# Altium project Cartridge.PrjPCB
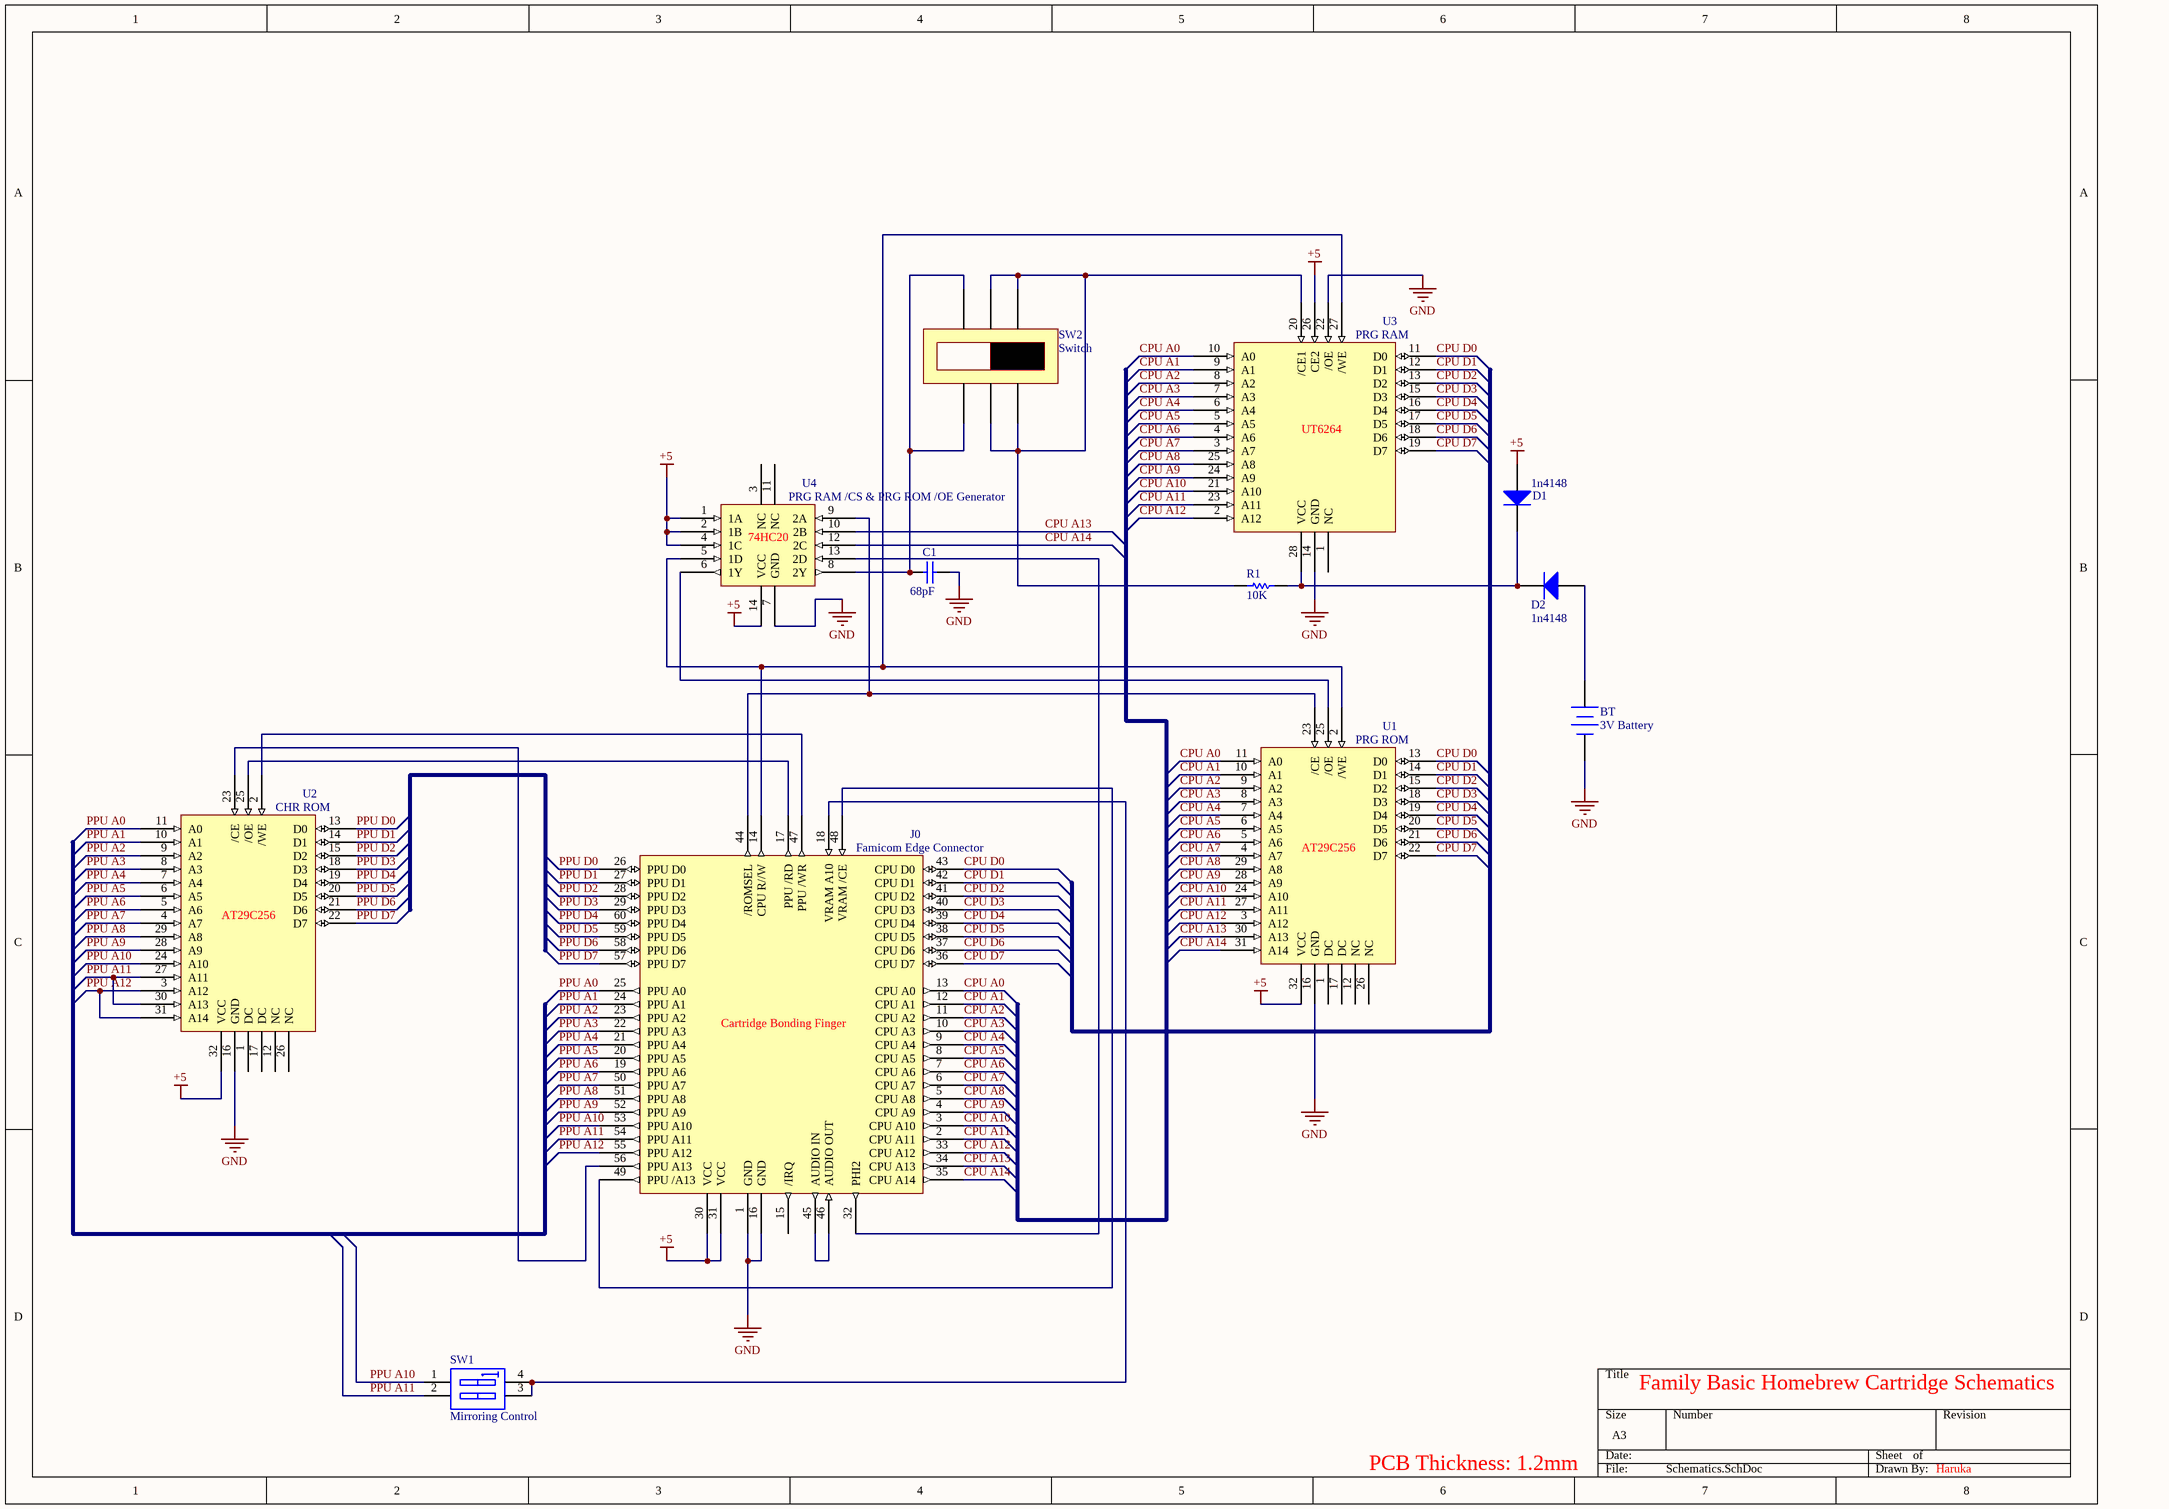
[diagram p0: Schematics.SchDoc]
1 sheet, 12 parts. Net scope: global (net labels, ports and power ports of the same name join across sheets).
Board file: PCB.PcbDoc

## Sheet Schematics.SchDoc: Family Basic Homebrew Cartridge Schematics
size A3; DrawnBy: Haruka; Engineer: Haruka

### Parts
BT  3V Battery  [BAT-2]
C1  value 68pF  [C2512]  (hidden comment: Cap Semi)
D1  1n4148  [DO-35]
D2  1n4148  [DO-35]
J0  Famicom Edge Connector  [CartridgeBondingFinger]
R1  value 10K  [AXIAL-0.3]  (hidden comment: Res1)
SW1  Mirroring Control  [DIP-4]
SW2  Switch  [DPDT-6]
U1  PRG ROM  [PLCC32]
U2  CHR ROM  [PLCC32]
U3  PRG RAM  [SOP127P1207-28N]
U4  PRG RAM /CS & PRG ROM /OE Generator  [SOP127P636-14N]

### Nets
+5: D1.1(A) J0.30(VCC) J0.31(VCC) U1.32(VCC) U2.32(VCC) U3.26(CE2) U4.1(1A) U4.2(1B) U4.4(1C) U4.14(VCC)
GND: BT.2(-) C1.2 J0.1(GND) J0.16(GND) U1.16(GND) U2.16(GND) U3.14(GND) U3.22(/OE) U4.7(GND)
CPU A0: J0.13(CPU_A0) U1.11(A0) U3.10(A0)
CPU A1: J0.12(CPU_A1) U1.10(A1) U3.9(A1)
CPU A2: J0.11(CPU_A2) U1.9(A2) U3.8(A2)
CPU A3: J0.10(CPU_A3) U1.8(A3) U3.7(A3)
CPU A4: J0.9(CPU_A4) U1.7(A4) U3.6(A4)
CPU A5: J0.8(CPU_A5) U1.6(A5) U3.5(A5)
CPU A6: J0.7(CPU_A6) U1.5(A6) U3.4(A6)
CPU A7: J0.6(CPU_A7) U1.4(A7) U3.3(A7)
CPU A8: J0.5(CPU_A8) U1.29(A8) U3.25(A8)
CPU A9: J0.4(CPU_A9) U1.28(A9) U3.24(A9)
CPU A10: J0.3(CPU_A10) U1.24(A10) U3.21(A10)
CPU A11: J0.2(CPU_A11) U1.27(A11) U3.23(A11)
CPU A12: J0.33(CPU_A12) U1.3(A12) U3.2(A12)
CPU A13: J0.34(CPU_A13) U1.30(A13) U4.10(2B)
CPU A14: J0.35(CPU_A14) U1.31(A14) U4.12(2C)
CPU D0: J0.43(CPU_D0) U1.13(D0) U3.11(D0)
CPU D1: J0.42(CPU_D1) U1.14(D1) U3.12(D1)
CPU D2: J0.41(CPU_D2) U1.15(D2) U3.13(D2)
CPU D3: J0.40(CPU_D3) U1.18(D3) U3.15(D3)
CPU D4: J0.39(CPU_D4) U1.19(D4) U3.16(D4)
CPU D5: J0.38(CPU_D5) U1.20(D5) U3.17(D5)
CPU D6: J0.37(CPU_D6) U1.21(D6) U3.18(D6)
CPU D7: J0.36(CPU_D7) U1.22(D7) U3.19(D7)
PPU A0: J0.25(PPU_A0) U2.11(A0)
PPU A1: J0.24(PPU_A1) U2.10(A1)
PPU A2: J0.23(PPU_A2) U2.9(A2)
PPU A3: J0.22(PPU_A3) U2.8(A3)
PPU A4: J0.21(PPU_A4) U2.7(A4)
PPU A5: J0.20(PPU_A5) U2.6(A5)
PPU A6: J0.19(PPU_A6) U2.5(A6)
PPU A7: J0.50(PPU_A7) U2.4(A7)
PPU A8: J0.51(PPU_A8) U2.29(A8)
PPU A9: J0.52(PPU_A9) U2.28(A9)
PPU A10: J0.53(PPU_A10) SW1.1(A1) U2.24(A10)
PPU A11: J0.54(PPU_A11) SW1.2(A2) U2.27(A11) U2.30(A13)
PPU A12: J0.55(PPU_A12) U2.3(A12) U2.31(A14)
PPU D0: J0.26(PPU_D0) U2.13(D0)
PPU D1: J0.27(PPU_D1) U2.14(D1)
PPU D2: J0.28(PPU_D2) U2.15(D2)
PPU D3: J0.29(PPU_D3) U2.18(D3)
PPU D4: J0.60(PPU_D4) U2.19(D4)
PPU D5: J0.59(PPU_D5) U2.20(D5)
PPU D6: J0.58(PPU_D6) U2.21(D6)
PPU D7: J0.57(PPU_D7) U2.22(D7)
NetBT_1: BT.1(+) D2.1(A)
NetC1_1: C1.1 SW2.SWITCH_A1 SW2.SWITCH_A2 U4.8(2Y)
NetD1_2: D1.2(K) D2.2(K) R1.1 U3.28(VCC)
NetJ0_14: J0.14(CPU_R//W) U1.2(/WE) U3.27(/WE) U4.5(1D)
NetJ0_17: J0.17(PPU_/RD) U2.25(/OE)
NetJ0_18: J0.18(VRAM_A10) SW1.3(B2) SW1.4(B1)
NetJ0_32: J0.32(PHI2) U4.13(2D)
NetJ0_44: J0.44(/ROMSEL) U1.23(/CE) U4.9(2A)
NetJ0_45: J0.45(AUDIO_IN) J0.46(AUDIO_OUT)
NetJ0_47: J0.47(PPU_/WR) U2.2(/WE)
NetJ0_48: J0.48(VRAM_/CE) J0.49(PPU_/A13)
NetJ0_56: J0.56(PPU_A13) U2.23(/CE)
NetR1_2: R1.2 SW2.SWITCH_B1 SW2.SWITCH_B2 SW2.SWITCH_C1 SW2.SWITCH_C2 U3.20(/CE1)
NetU1_25: U1.25(/OE) U4.6(1Y)

Not connected (* = marked no-connect by the designer): J0 15(/IRQ); U1 1(DC) 12(NC) 17(DC) 26(NC); U2 1(DC) 12(NC) 17(DC) 26(NC); U3 1(NC); U4 3(NC) 11(NC)

### Notes on the sheet
- Family Basic Homebrew Cartridge Schematics
- PCB Thickness: 1.2mm
- Haruka
- (in symbol CartridgeBondingFinger) Cartridge Bonding Finger

### Library data of the parts
BT = Battery: Multicell Battery; Published: 24-Mar-1999; LatestRevisionDate: 17-Jul-2002; LatestRevisionNote: Re-released for DXP Platform.; PackageReference: BAT-2; Publisher: Altium Limited; PackageDescription: Battery; 2 Leads
C1 = Cap Semi: Capacitor (Semiconductor SIM Model); Published: 8-Jun-2000; LatestRevisionDate: 29-May-2009; LatestRevisionNote: IPC-7351 Footprint Added.; PackageReference: C1206; Publisher: Altium Limited; PackageDescription: Chip Capacitor
D1 D2 = Diode 1N4148: High Conductance Fast Diode; Published: 8-Jun-2000; LatestRevisionDate: 17-Jul-2002; LatestRevisionNote: Re-released for DXP Platform.; DatasheetVersion: 1997; PackageReference: DO-35; Publisher: Altium Limited; PackageDescription: Diode, Axial; Body 3.8 x 1.9 mm (LxDia. max), Lead Dia. 0.53 mm (max); Code_JEDEC: DO-204-AH; ComponentLink1Description: Manufacturer Link; ComponentLink1URL: http://www.fairchildsemi.com/; ComponentLink2Description: Datasheet; ComponentLink2URL: http://www.fairchildsemi.com/ds/1N%2F1N4148.pdf
J0 = CartridgeBondingFinger
R1 = Res1: Resistor; Published: 8-Jun-2000; LatestRevisionDate: 17-Jul-2002; LatestRevisionNote: Re-released for DXP Platform.; PackageReference: AXIAL-0.3; Publisher: Altium Limited; PackageDescription: Axial Device, Thru-Hole; 2 Leads; 0.3 in Pin Spacing
SW1 = SW DIP-2: DIP Switch, 2 Position, SPST; Published: 24-Mar-1999; LatestRevisionDate: 17-Jul-2002; LatestRevisionNote: Re-released for DXP Platform.; PackageReference: DIP-4; Publisher: Altium Limited
SW2 = Switch: pin to pad: SWITCH_A1>3 SWITCH_A2>4 SWITCH_B1>1 SWITCH_B2>6 SWITCH_C1>2 SWITCH_C2>5
U1 U2 = AT29C256
U3 = UT6264
U4 = 74HC20